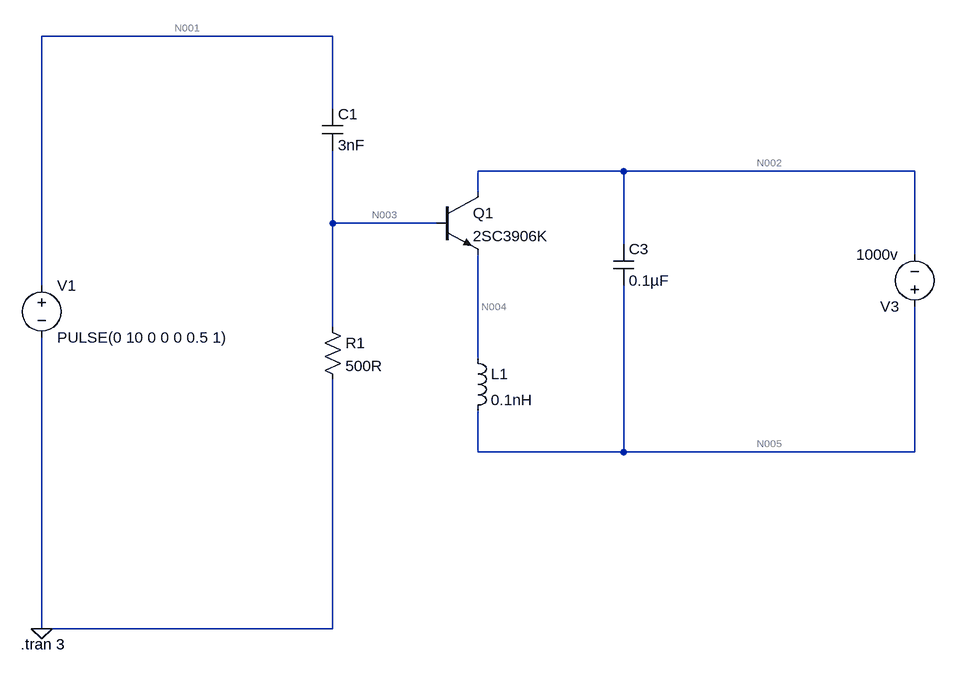
[diagram p0: schematic transistor.asc]
transistor.asc, the LTspice schematic file:
Version 4
SHEET 1 980 728
WIRE -48 -224 -496 -224
WIRE -48 -112 -48 -224
WIRE 400 -16 176 -16
WIRE 848 -16 400 -16
WIRE 176 16 176 -16
WIRE -48 64 -48 -48
WIRE 112 64 -48 64
WIRE 400 96 400 -16
WIRE 848 112 848 -16
WIRE -496 160 -496 -224
WIRE -48 224 -48 64
WIRE 176 272 176 112
WIRE 176 416 176 352
WIRE 400 416 400 160
WIRE 400 416 176 416
WIRE 848 416 848 192
WIRE 848 416 400 416
WIRE -496 688 -496 240
WIRE -48 688 -48 304
WIRE -48 688 -496 688
FLAG -496 688 0
SYMBOL voltage -496 144 R0
WINDOW 123 0 0 Left 0
WINDOW 39 0 0 Left 0
SYMATTR InstName V1
SYMATTR Value PULSE(0 10 0 0 0 0.5 1)
SYMBOL npn2 112 16 R0
SYMATTR InstName Q1
SYMATTR Value 2SC3906K
SYMBOL ind 160 256 R0
SYMATTR InstName L1
SYMATTR Value 0.1nH
SYMBOL res -64 208 R0
SYMATTR InstName R1
SYMATTR Value 500R
SYMBOL cap 384 96 R0
SYMATTR InstName C3
SYMATTR Value 0.1µF
SYMBOL cap -64 -112 R0
SYMATTR InstName C1
SYMATTR Value 3nF
SYMBOL voltage 848 208 R180
WINDOW 123 0 0 Left 0
WINDOW 39 0 0 Left 0
SYMATTR InstName V3
SYMATTR Value 1000v
TEXT -528 712 Left 2 !.tran 3

The netlist it stands for:
* transistor.asc
V1 N001 0 PULSE(0 10 0 0 0 0.5 1)
Q1 N002 N003 N004 0 2SC3906K
L1 N004 N005 0.1nH
R1 N003 0 500R
C3 N002 N005 0.1µF
C1 N001 N003 3nF
V3 N005 N002 1000v
.model NPN NPN
.model PNP PNP
.lib standard.bjt
.tran 3
.backanno
.end

* Results of the author's LTspice run, read from the files saved beside the schematic
* Operating Point, zero values left out:
*   V(n002) = -94.95 mV
*   V(n004) = 999.9 V
*   V(n005) = 999.9 V
*   Ic(Q1) = -954.4 pA
*   Ib(Q1) = -72.91 pA
*   Ie(Q1) = 1.027 nA
*   I(L1) = -1.137 nA
*   I(R1) = 72.91 pA
*   I(V3) = -954.3 pA
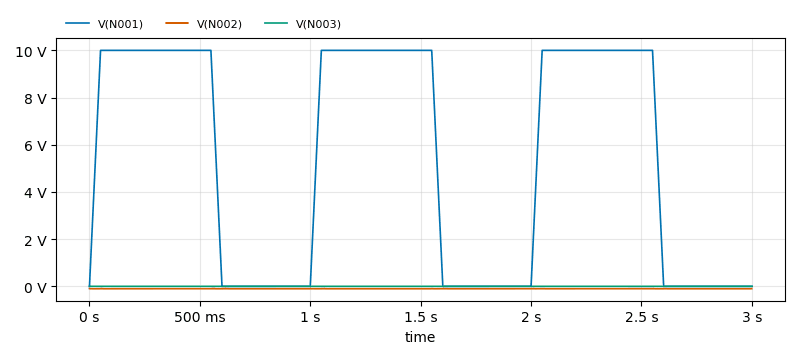
[diagram p1: Transient Analysis of transistor.asc, plotted from the saved traces]
* Transient Analysis, 1 run:
*   V(N001): min 0 V, max 10 V, average 5.5 V, rms 7.307 V, last 0 V
*   V(N002): min -104.1 mV, max -91.06 mV, average -102.4 mV, rms 102.4 mV, last -95.94 mV
*   V(N003): min -301.9 µV, max 305.2 µV, average 43.72 nV, rms 94.79 µV, last 32.73 nV